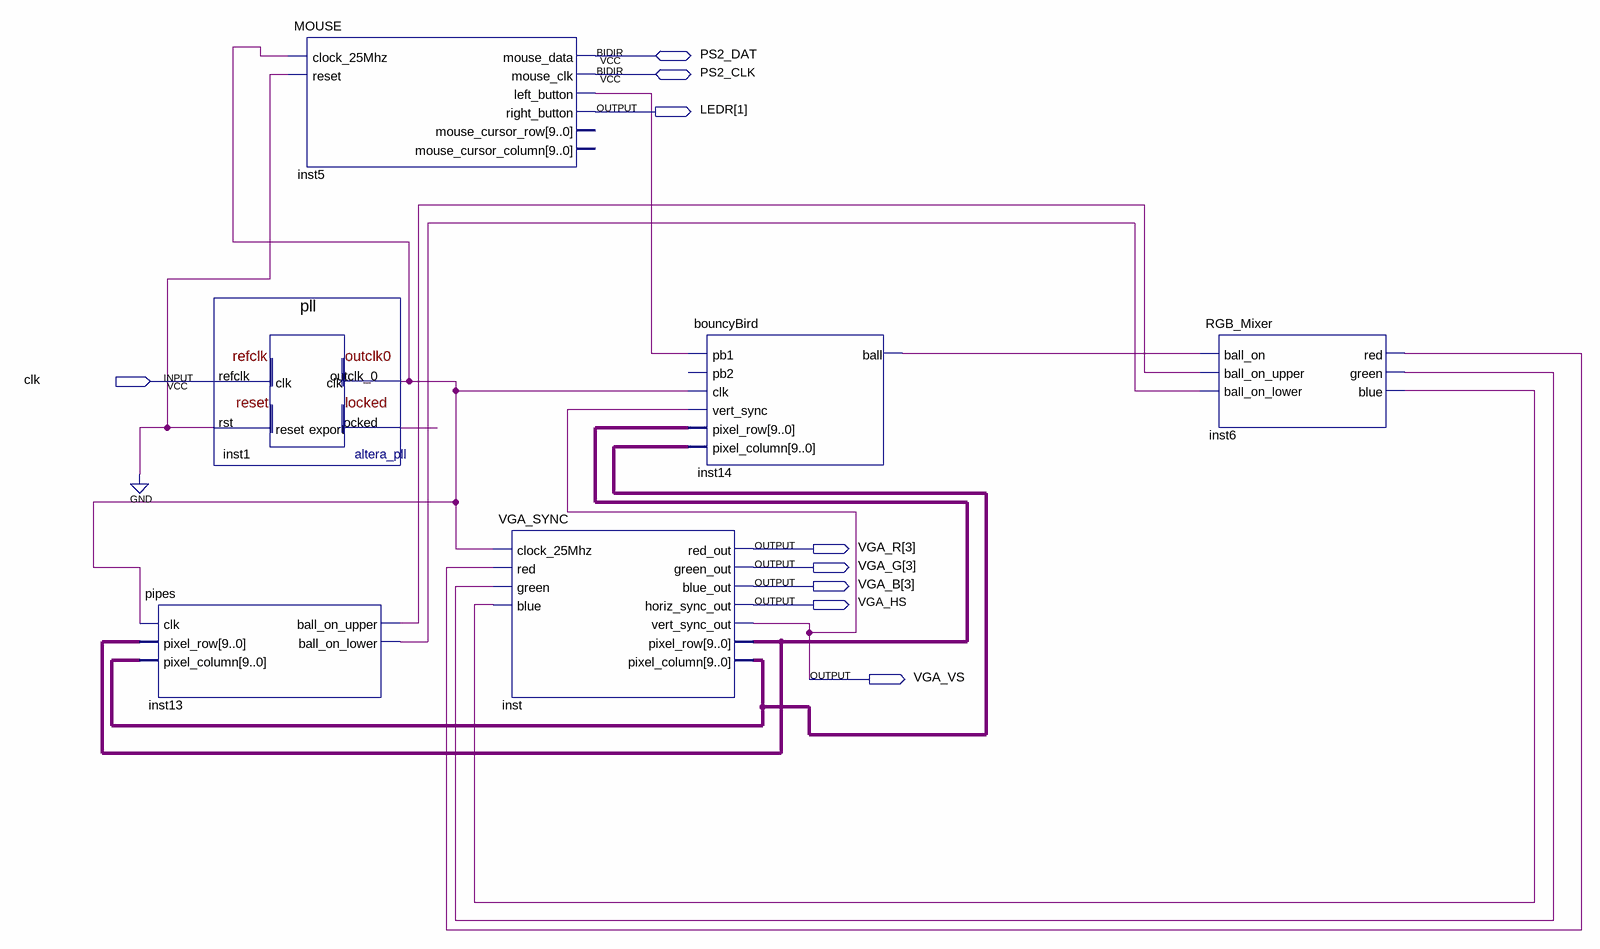
[diagram p0: schematic sheet]
// Quartus schematic gameTesting.bdf as structural Verilog: 6 symbols, 9 pins
module gameTesting (
  input  clk,
  inout  PS2_DAT,
  inout  PS2_CLK,
  output [1:1] LEDR,
  output [3:3] VGA_R,
  output [3:3] VGA_G,
  output [3:3] VGA_B,
  output VGA_HS,
  output VGA_VS
);

  wire inst1_locked, inst1_outclk_0, inst5_left_button, inst6_blue, inst6_green, inst6_red,
       inst13_ball_on_lower, inst13_ball_on_upper, inst14_ball;
  wire [9:0] inst_pixel_column, inst_pixel_row;

  pipes inst13 (
    .clk(inst1_outclk_0), .pixel_row(inst_pixel_row), .pixel_column(inst_pixel_column),
    .ball_on_upper(inst13_ball_on_upper), .ball_on_lower(inst13_ball_on_lower));
  pll inst1 (.refclk(clk), .rst(1'b0), .outclk_0(inst1_outclk_0), .locked(inst1_locked));
  MOUSE inst5 (
    .clock_25Mhz(inst1_outclk_0), .reset(1'b0), .left_button(inst5_left_button), .right_button(LEDR[1]),
    .mouse_data(PS2_DAT), .mouse_clk(PS2_CLK));  // open: mouse_cursor_row, mouse_cursor_column
  VGA_SYNC inst (
    .clock_25Mhz(inst1_outclk_0), .red(inst6_red), .green(inst6_green), .blue(inst6_blue),
    .red_out(VGA_R[3]), .green_out(VGA_G[3]), .blue_out(VGA_B[3]), .horiz_sync_out(VGA_HS),
    .vert_sync_out(VGA_VS), .pixel_row(inst_pixel_row), .pixel_column(inst_pixel_column));
  bouncyBird inst14 (
    .pb1(inst5_left_button), .clk(inst1_outclk_0), .vert_sync(VGA_VS), .pixel_row(inst_pixel_row),
    .pixel_column(inst_pixel_column), .ball(inst14_ball));  // open: pb2
  RGB_Mixer inst6 (
    .ball_on(inst14_ball), .ball_on_upper(inst13_ball_on_upper), .ball_on_lower(inst13_ball_on_lower),
    .red(inst6_red), .green(inst6_green), .blue(inst6_blue));
endmodule
